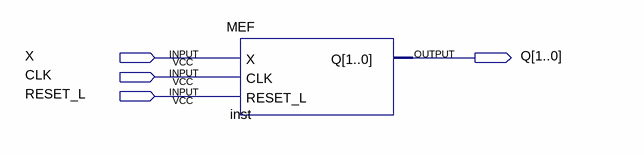
[diagram p0: schematic sheet]
// Quartus schematic MEFsymbol.bdf as structural Verilog: 1 symbols, 4 pins
module MEFsymbol (
  input  X,
  input  CLK,
  input  RESET_L,
  output [1:0] Q
);

  MEF inst (.X(X), .CLK(CLK), .RESET_L(RESET_L), .Q(Q));
endmodule
